# Altium schematic sheet 行天宮-流亡暗道_20240815.SchDoc
size A3
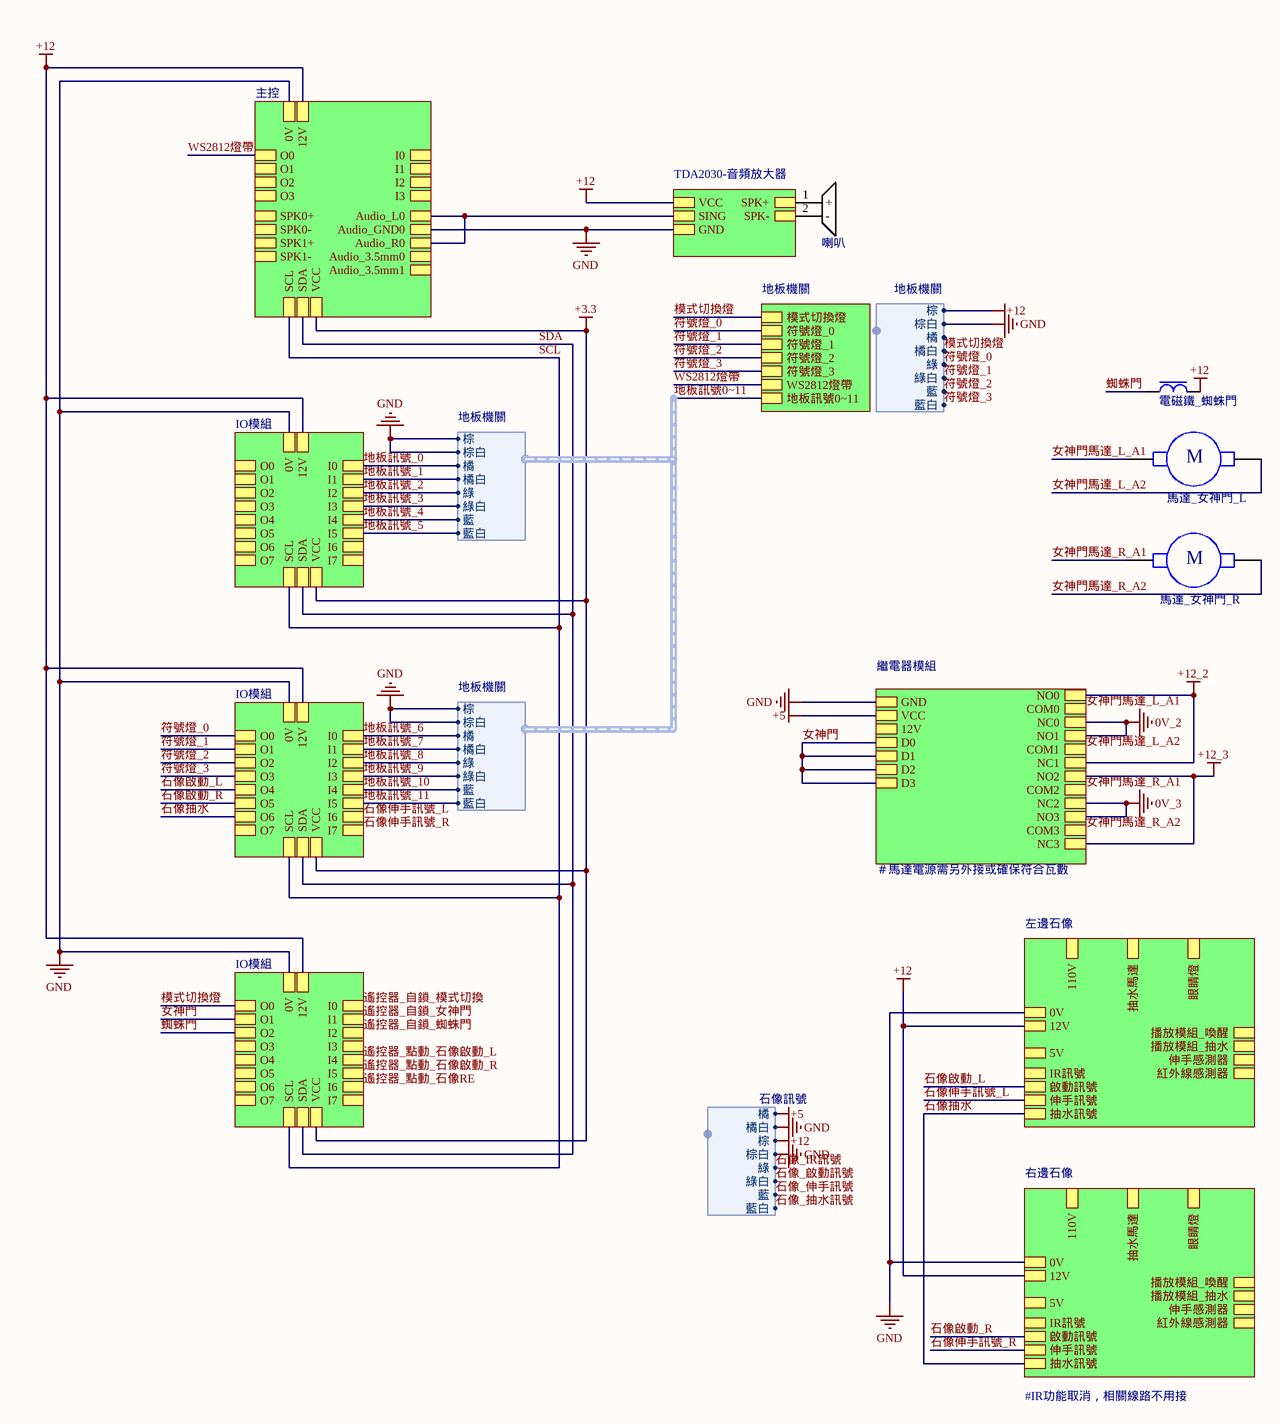
[diagram p0: 行天宮-流亡暗道_20240815.SchDoc]

## Parts
B9  喇叭  [Buzzer_12085]
I6  電磁鐵_蜘蛛門  [Inductor-0420]
MD1  馬達_女神門_L
MD2  馬達_女神門_R

## Sub-sheets
IO模組 = IO模組_MCP23017_20240819.SchDoc: O5, O7, O3, I6, I7, O4, O1, I0, I1, I2, I3, I4, I5, O6, O2, O0, VCC, 12V, 0V, SCL, SDA
IO模組 = IO模組_MCP23017_20240819.SchDoc: O5, O7, O3, I6, I7, O4, O1, I0, I1, I2, I3, I4, I5, O6, O2, O0, VCC, 12V, 0V, SCL, SDA
IO模組 = IO模組_MCP23017_20240815.SchDoc: O5, O7, O3, I6, I7, O4, O1, I0, I1, I2, I3, I4, I5, O6, O2, O0, VCC, 12V, 0V, SCL, SDA
TDA2030-音頻放大器 = File Name: VCC, SING, GND, SPK-, SPK+
主控 = ESP32主控_20241002.SchDoc: 12V, SDA, VCC, 0V, SCL, O3, O2, O1, O0, I3, I2, I1, I0, SPK0+, Audio_3.5mm1, Audio_L0, SPK0-, Audio_R0, SPK1+, SPK1-, Audio_3.5mm0, Audio_GND0
右邊石像 = 行天宮-流亡暗道-石像.SchDoc: 播放模組_抽水, 伸手訊號, 0V, 啟動訊號, 伸手感測器, 5V, 110V, 抽水訊號, 12V, 播放模組_喚醒, IR訊號, 眼睛燈, 紅外線感測器, 抽水馬達
地板機關 = File Name: 模式切換燈, 符號燈_0, 符號燈_1, 符號燈_3, 符號燈_2, 地板訊號0~11, WS2812燈帶
左邊石像 = 行天宮-流亡暗道-石像.SchDoc: 播放模組_抽水, 伸手訊號, 0V, 啟動訊號, 伸手感測器, 5V, 110V, 抽水訊號, 12V, 播放模組_喚醒, IR訊號, 眼睛燈, 紅外線感測器, 抽水馬達
繼電器模組 = 遙控繼電器.SchDoc: COM0, NO1, NO2, COM1, NC0, NO3, NO0, VCC, COM2, NC2, NC3, COM3, NC1, GND, 12V, D3, D2, D1, D0

## Harnesses
石像訊號: 橘白, 橘, 棕, 棕白, 綠白, 綠, 藍, 藍白
地板機關: 橘白, 橘, 棕, 棕白, 綠白, 綠, 藍, 藍白

## Nets
0V_2: sheet 繼電器模組/NO1, sheet 繼電器模組/NC0
0V_3: sheet 繼電器模組/NO3, sheet 繼電器模組/NC2
+3.3: sheet 主控/VCC, sheet IO模組/VCC, sheet IO模組/VCC, sheet IO模組/VCC
+5: sheet 繼電器模組/VCC, harness 石像訊號.橘
+12: I6.2 ; sheet 左邊石像/12V, sheet 主控/12V, sheet IO模組/12V, sheet IO模組/12V, sheet IO模組/12V, sheet 右邊石像/12V, sheet TDA2030-音頻放大器/VCC, harness 石像訊號.棕, harness 地板機關.棕
+12_2: sheet 繼電器模組/NO0, sheet 繼電器模組/NC1
+12_3: sheet 繼電器模組/NO2, sheet 繼電器模組/NC3
GND: sheet 左邊石像/0V, sheet 主控/0V, sheet 主控/Audio_GND0, sheet IO模組/0V, sheet IO模組/0V, sheet IO模組/0V, sheet 右邊石像/0V, sheet 繼電器模組/GND, sheet TDA2030-音頻放大器/GND, harness 石像訊號.橘白, harness 石像訊號.棕白, harness 地板機關.棕白, harness 地板機關.棕
SCL: sheet 主控/SCL, sheet IO模組/SCL, sheet IO模組/SCL, sheet IO模組/SCL
SDA: sheet 主控/SDA, sheet IO模組/SDA, sheet IO模組/SDA, sheet IO模組/SDA
WS2812燈帶: sheet 主控/O0, sheet 地板機關/WS2812燈帶
地板訊號0~11: sheet 地板機關/地板訊號0~11
地板訊號_0: sheet IO模組/I0, sheet IO模組/I0, harness 地板機關.橘  [also labelled 地板訊號_6]
地板訊號_1: sheet IO模組/I1, sheet IO模組/I1, harness 地板機關.橘白  [also labelled 地板訊號_7]
地板訊號_2: sheet IO模組/I2, sheet IO模組/I2, harness 地板機關.綠  [also labelled 地板訊號_8]
地板訊號_3: sheet IO模組/I3, sheet IO模組/I3, harness 地板機關.綠白  [also labelled 地板訊號_9]
地板訊號_10: sheet IO模組/I4, sheet IO模組/I4, harness 地板機關.藍  [also labelled 地板訊號_4]
地板訊號_11: sheet IO模組/I5, sheet IO模組/I5, harness 地板機關.藍白  [also labelled 地板訊號_5]
女神門: sheet IO模組/O1, sheet 繼電器模組/D3, sheet 繼電器模組/D2, sheet 繼電器模組/D1, sheet 繼電器模組/D0
女神門馬達_L_A1: MD1.4 ; sheet 繼電器模組/COM0
女神門馬達_L_A2: MD1.4 ; sheet 繼電器模組/COM1
女神門馬達_R_A1: MD2.4 ; sheet 繼電器模組/COM2
女神門馬達_R_A2: MD2.4 ; sheet 繼電器模組/COM3
模式切換燈: sheet 地板機關/模式切換燈, sheet IO模組/O0, harness 地板機關.橘白
石像_IR訊號: harness 石像訊號.綠
石像_伸手訊號: harness 石像訊號.藍
石像_啟動訊號: harness 石像訊號.綠白
石像_抽水訊號: harness 石像訊號.藍白
石像伸手訊號_L: sheet 左邊石像/伸手訊號, sheet IO模組/I6
石像伸手訊號_R: sheet IO模組/I7, sheet 右邊石像/伸手訊號
石像啟動_L: sheet 左邊石像/啟動訊號, sheet IO模組/O4
石像啟動_R: sheet IO模組/O5, sheet 右邊石像/啟動訊號
石像抽水: sheet 左邊石像/抽水訊號, sheet IO模組/O6, sheet 右邊石像/抽水訊號
符號燈_0: sheet 地板機關/符號燈_0, sheet IO模組/O0, harness 地板機關.綠
符號燈_1: sheet 地板機關/符號燈_1, sheet IO模組/O1, harness 地板機關.綠白
符號燈_2: sheet 地板機關/符號燈_2, sheet IO模組/O2, harness 地板機關.藍
符號燈_3: sheet 地板機關/符號燈_3, sheet IO模組/O3, harness 地板機關.藍白
蜘蛛門: I6.1 ; sheet IO模組/O2
遙控器_自鎖_女神門: sheet IO模組/I1
遙控器_自鎖_模式切換: sheet IO模組/I0
遙控器_自鎖_蜘蛛門: sheet IO模組/I2
遙控器_點動_石像RE: sheet IO模組/I6
遙控器_點動_石像啟動_L: sheet IO模組/I4
遙控器_點動_石像啟動_R: sheet IO模組/I5
NetB9_1: B9.1(+) ; sheet TDA2030-音頻放大器/SPK+
NetB9_2: B9.2(-) ; sheet TDA2030-音頻放大器/SPK-
(unnamed): sheet 主控/Audio_L0, sheet 主控/Audio_R0, sheet TDA2030-音頻放大器/SING

## Notes on the sheet
- ＃馬達電源需另外接或確保符合瓦數
- #IR功能取消，相關線路不用接
- (in symbol Motor_DC) M

## Library data of the parts
B9 = Buzzer: 無源蜂鳴器
I6 = Inductor: 一體成型電感
MD1 MD2 = Motor_DC: 直流馬達